# EAGLE design owTemp (EAGLE 5.09)
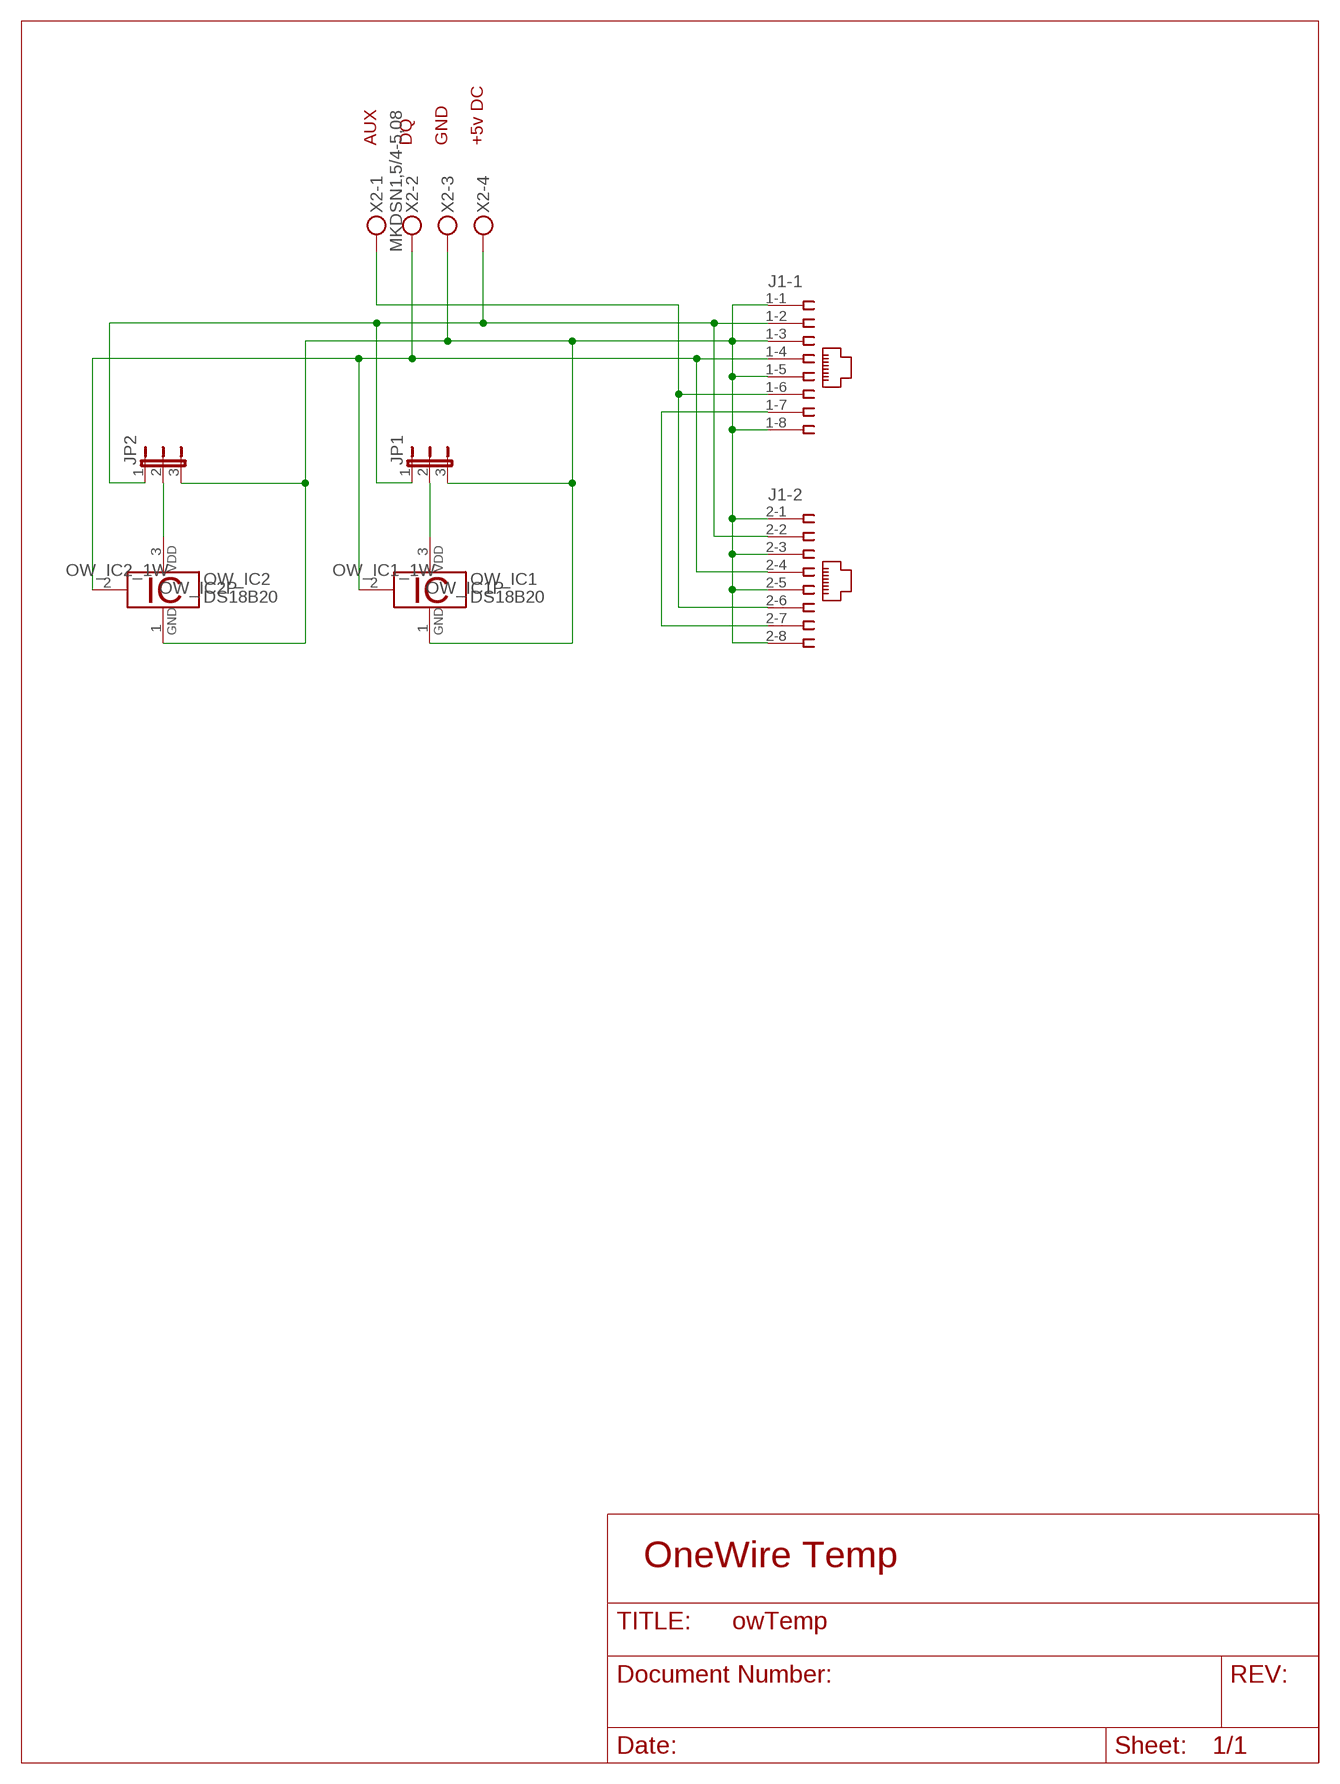
[diagram p0: schematic, sheet 1]

## Parts
J1  557560-1  [557560-1]
JP1  JP2E  [JP2]
JP2  JP2E  [JP2]
OW_IC1  DS18B20  [TO92-]
OW_IC2  DS18B20  [TO92-]
X2  MKDSN1,5/4-5,08  [MKDSN1,5/4-5,08]

## Nets
+5V: J1.1-2 J1.2-2 JP1.1 JP2.1 X2.4
DQ: J1.1-4 J1.2-4 OW_IC1.2 OW_IC2.2 X2.2
GND: J1.1-1 J1.1-3 J1.1-5 J1.1-8 J1.2-1 J1.2-3 J1.2-5 J1.2-8 JP1.3 JP2.3 OW_IC1.1 OW_IC2.1 X2.3
N$6: J1.1-6 J1.2-6 X2.1
N$7: J1.1-7 J1.2-7
N$9: JP1.2 OW_IC1.3
N$10: JP2.2 OW_IC2.3

## Notes on the sheet
- AUX | DQ | GND | +5v DC
- OneWire Temp

## Library data of the parts
J1 = con-amp:557560-1: AMP connector
JP1 JP2 = jumper:JP2E: JUMPER
OW_IC1 OW_IC2 = 1wire:DS18B20: Programmable Resolution Digital Thermometer This chip provides a onewire thermosensor with approx. 0.5°C accuracy. A programmable over/undertemperure alarm is available. The precision can be set from 9..12 bits. Notes: Vdd must be applied for accurate measurements at low temperatures, as the parasite power circuit otherwise heats the sensor. If parasite power is used, Vdd has to be connected to GND. The DS1822 is a low-cost thermometer chip, the DS18S20 is similar to the DS18B20, but with 9 Bit precision only. Author: Jan Kandziora <jjj@gmx.de>
X2 = con-phoenix-508:MKDSN1,5/4-5,08: MKDSN 1,5/ 4-5,08 Printklemme Nennstrom: 13,5 A Nennspannung: 250 V Rastermaß: 5,08 mm Polzahl: 4 Anschlussart: Schraubanschluss Montage: Löten Anschlussrichtung Leiter/Platine: 0 ° Artikelnummer: 1729144 Source: http://eshop.phoenixcontact.com .. 1729144.pdf

## Board
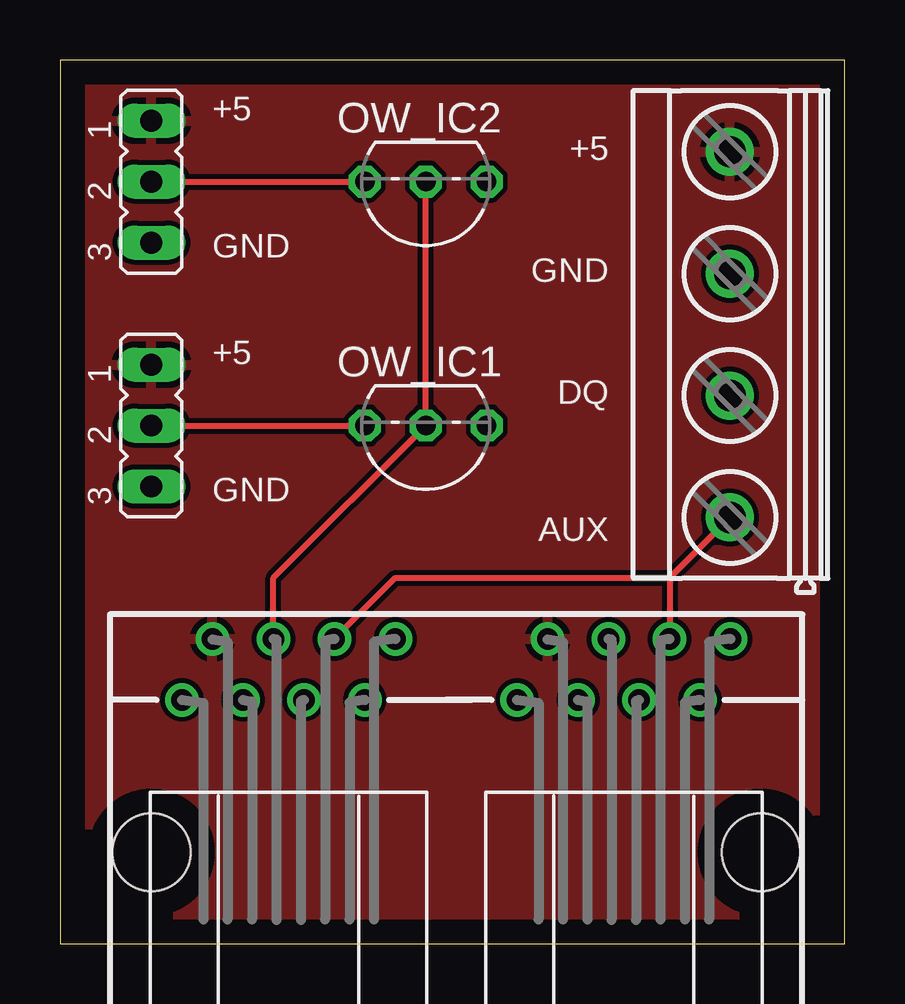
[diagram p1: board, top side]
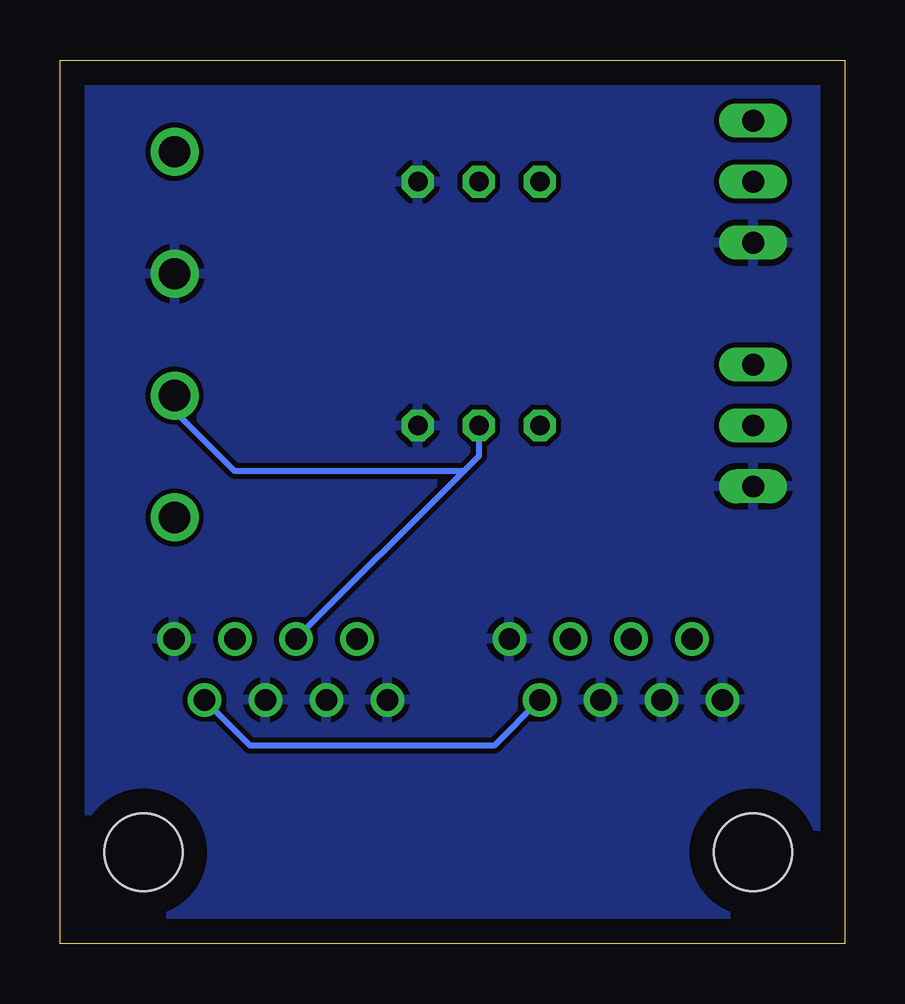
[diagram p2: board, bottom side, seen from below]

Size 32.69 x 36.82 mm. Coordinates in mm from the lower left corner, seen from the top.
Outline: 0,0 32.69,0 32.69,36.82 0,36.82 0,0
Copper layers (1*16): Top 0.035mm / dielectric 1.5mm / Bottom 0.035mm
Design rules "default": minimum track width 10mil, minimum drill 24mil, track to track 8mil, track to pad 8mil, pad to pad 8mil, via to via 8mil, smd to smd 8mil, copper to edge 40mil, drill to drill 8mil, minimum pad ring 10mil, minimum via ring 8mil, stop-mask expansion 4mil, vias tented up to drill 0mil, thermal gap 10mil

### Footprints (pad centres in the part's own frame; a part is rotated, then mirrored left to right if it is on the bottom)
557560-1 = drill 0.889 round: 1-1 -11.43,6.35; 1-2 -10.16,8.89; 1-3 -8.89,6.35; 1-4 -7.62,8.89; 1-5 -6.35,6.35; 1-6 -5.08,8.89; 1-7 -3.81,6.35; 1-8 -2.54,8.89; 2-1 2.54,6.35; 2-2 3.81,8.89; 2-3 5.08,6.35; 2-4 6.35,8.89; 2-5 7.62,6.35; 2-6 8.89,8.89; 2-7 10.16,6.35; 2-8 11.43,8.89 | hole 3.251: -12.7,0; 12.7,0
JP2 = drill 0.914 long: 1 -2.54,0; 2 0,0; 3 2.54,0
TO92- = drill 0.813 octagon: 1 -2.54,0; 2 0,0; 3 2.54,0
MKDSN1,5/4-5,08 = drill 1.3 pad 2 round: 1 -7.641,0.025; 2 -2.561,0.025; 3 2.519,0.025; 4 7.599,0.025

### Placement (x,y rotation side)
J1  16.51,3.81 0 top
JP1  3.81,21.59 270 top
JP2  3.81,31.75 270 top
OW_IC1  15.24,21.59 180 top
OW_IC2  15.24,31.75 180 top
X2  27.94,25.4 90 top

### Tracks (layer width: path | path; a pad name or v marks a point on that pad's centre or on a via)
+5V
  pour Top: -2.54,39.37 35.56,39.37 35.56,-2.54 -2.54,-2.54
DQ
  Top 0.254: J1.1-4 8.89,15.24 OW_IC1.2 OW_IC2.2
  Bottom 0.254: 15.88,19.68 15.24,20.32 OW_IC1.2 | 15.88,19.68 J1.2-4 | 15.88,19.68 25.4,19.68 27.94,22.23 X2.2
GND
  pour Bottom: -1.27,38.1 34.29,38.1 34.29,-1.27 -1.27,-1.27
N$6
  Top 0.254: 27.94,17.78 27.94,18.41 | 27.94,17.78 X2.1 | 25.4,15.24 J1.2-6 | 25.4,15.24 27.94,17.78 | J1.1-6 13.97,15.24 25.4,15.24
N$7
  Bottom 0.254: J1.1-7 14.61,8.26 24.77,8.26 J1.2-7
N$9
  Top 0.254: JP1.2 OW_IC1.3
N$10
  Top 0.254: JP2.2 OW_IC2.3

### Text on the board
tNames: +5 | +5 | GND | GND | +5 | DQ | GND | AUX